# Altium schematic sheet Memory_schematic.SchDoc
size A1; SheetNumber: 1; SheetTotal: 1
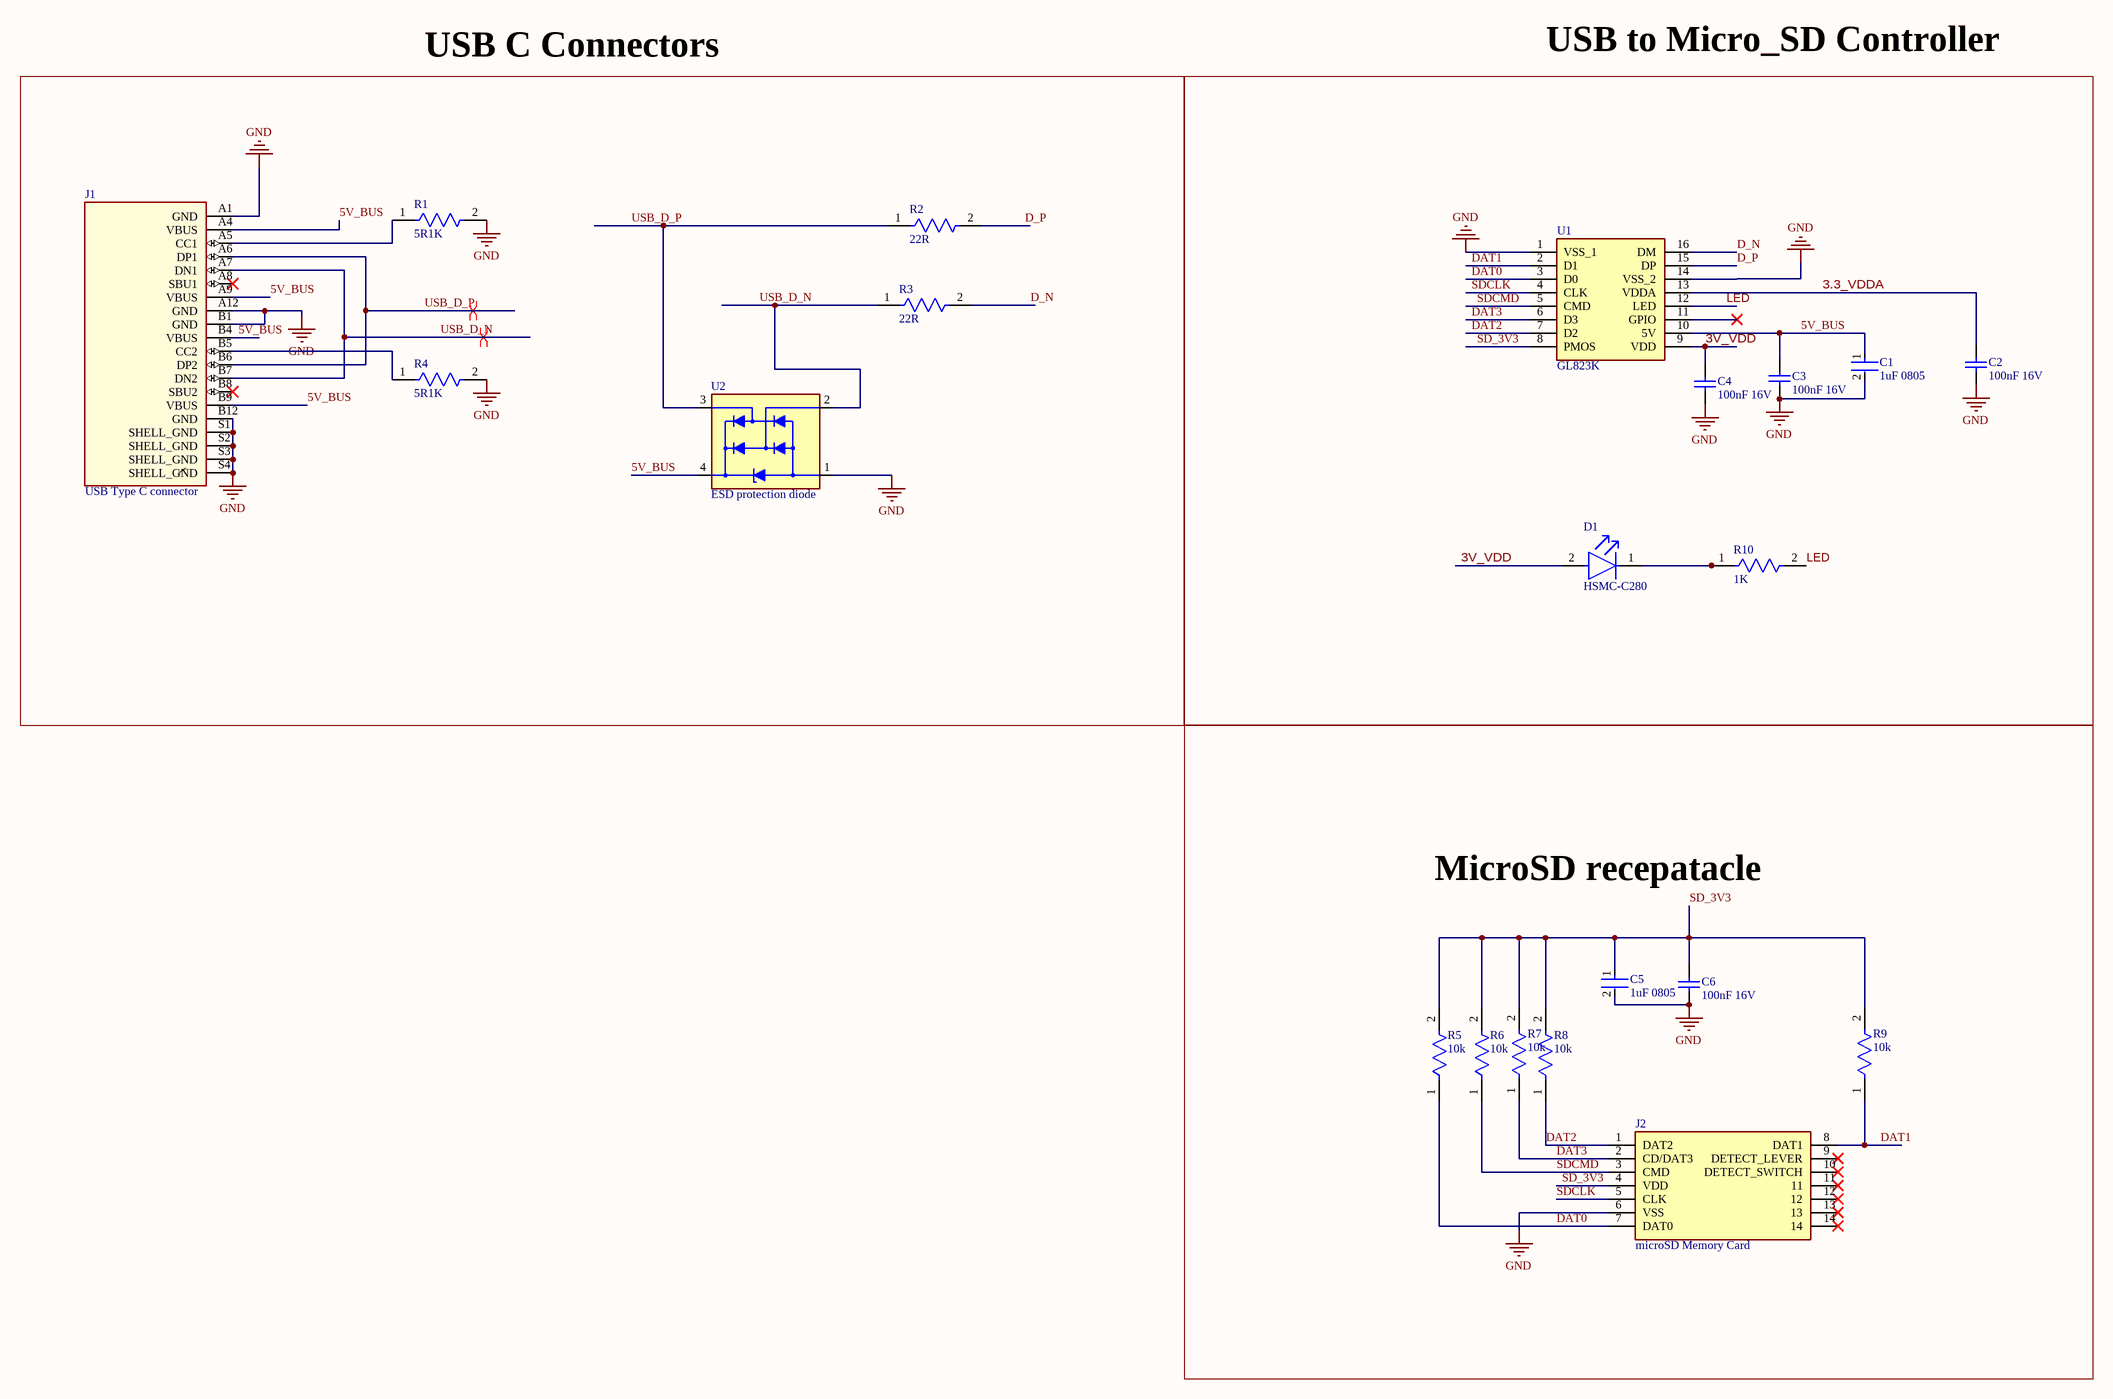
[diagram p0: Memory_schematic.SchDoc]

## Parts
C1  1uF 0805  [FP-CC0805-0_85-MFG]
C2  100nF 16V  [CAPC0805(2012)145_M]
C3  100nF 16V  [CAPC0805(2012)145_M]
C4  100nF 16V  [CAPC0805(2012)145_M]
C5  1uF 0805  [FP-CC0805-0_85-MFG]
C6  100nF 16V  [CAPC0805(2012)145_M]
D1  HSMC-C280  [FP-HSMC-C280-MFG]
J1  USB Type C connector  [CONN16_C16PIN_SHN]
J2  microSD Memory Card  [5033981892]
R1  5R1K  [FP-RN73R2A-IPC_C]
R2  22R  [FP-RT0805-MFG]
R3  22R  [FP-RT0805-MFG]
R4  5R1K  [FP-RN73R2A-IPC_C]
R5  10k  [FP-CRGP0805-IPC_C]
R6  10k  [FP-CRGP0805-IPC_C]
R7  10k  [FP-CRGP0805-IPC_C]
R8  10k  [FP-CRGP0805-IPC_C]
R9  10k  [FP-CRGP0805-IPC_C]
R10  1K  [FP-RN73R2A-IPC_A]
U1  GL823K  [SOP64P600X175-16N]
U2  ESD protection diode  [SOT190P230X110-4N]

## Blocks framed on the sheet
USB C Connectors: J1 R1-R4 U2
USB to Micro_SD Controller: C1-C4 D1 R10 U1
MicroSD recepatacle: C5 C6 J2 R5-R9

## Nets
GND: C1.2 C2.1 C3.1 C4.1 C5.2 C6.1 J1.A1(GND) J1.A12(GND) J1.B1(GND) J1.B12(GND) J1.S1(SHELL_GND) J1.S2(SHELL_GND) J1.S3(SHELL_GND) J1.S4(SHELL_GND) J2.6(VSS) R1.2 R4.2 U1.1(VSS_1) U1.14(VSS_2) U2.1(GND)
3.3_VDDA: C2.2 U1.13(VDDA)
3V_VDD: C4.2 D1.2(A) U1.9(VDD)
5V_BUS: C1.1 C3.2 J1.A4(VBUS) J1.A9(VBUS) J1.B4(VBUS) J1.B9(VBUS) U1.10(5V) U2.4(VCC)
D_N: R3.2 U1.16(DM)
D_P: R2.2 U1.15(DP)
DAT0: J2.7(DAT0) R5.1 U1.3(D0)
DAT1: J2.8(DAT1) R9.1 U1.2(D1)
DAT2: J2.1(DAT2) R8.1 U1.7(D2)
DAT3: J2.2(CD/DAT3) R7.1 U1.6(D3)
LED: R10.2 U1.12(LED)
SD_3V3: C5.1 C6.2 J2.4(VDD) R5.2 R6.2 R7.2 R8.2 R9.2 U1.8(PMOS)
SDCLK: J2.5(CLK) U1.4(CLK)
SDCMD: J2.3(CMD) R6.1 U1.5(CMD)
USB_D_N: J1.A7(DN1) J1.B7(DN2) R3.1 U2.2(I/O_1)
USB_D_P: J1.A6(DP1) J1.B6(DP2) R2.1 U2.3(I/O_2)
NetD1_1: D1.1(C) R10.1
NetJ1_A5: J1.A5(CC1) R1.1
NetJ1_B5: J1.B5(CC2) R4.1

Not connected (* = marked no-connect by the designer): J1 A8(SBU1)* B8(SBU2)*; J2 9(DETECT_LEVER)* 10(DETECT_SWITCH)* 11* 12* 13* 14*; U1 11(GPIO)*

## Layout directives
differential pair: USB_D_N, USB_D_P

## Library data of the parts
C1 C5 = CMP-03422-000058-1: CC0805 1 uF X7R 10.00% 16 V; Manufacturer: Yageo; Manufacturer Part Number: CC0805KFX7R7BB105; Material: Ceramic; Tolerance: 0.1; Voltage Rating: 16 V; ComponentLink2URL: http://www.yageo.com/documents/recent/UPY-GPHC_Y5V_6.3V-to-50V_8.pdf; Capacitance: 1 uF; Octopart: https://octopart.com/cc0805kfx7r7bb105-yageo-30261725; Footprint Url: http://www.yageo.com/exep/pages/download/literatures/UPY-C_GEN_24.pdf; ComponentLink2Description: Datasheet; Ipc Land Pattern Name: CAPC200125X85; Category: Cap; Device Class L1: Passive Components; Temperature Range High: +85°C; Mouser Description: Multilayer Ceramic Capacitors MLCC - SMD/SMT 1.0uF 16V X7R 10%; Height: 0.95mm; Automotive: No; Device Class L3: Ceramic Capacitors; Temperature: -30°C to +85°C; Temperature Range Low: -30°C; Temperature Characteristic: X7R; Device Class L2: Capacitors; Lead Free: Yes; Value: 1 uF; RoHS: TRUE; Package: CC0805-0.85
C2-C4 C6 = CMP-1036-04399-1: CAP 100nF 16V ±5% 0805 (2012 Metric) Thickness 1.45mm SMD; Tolerance: Â±5%; Case-Metric: 2012; Case-EIA: 0805; Value: 100nF; Rated Voltage: 16 V; Max Thickness: 1.45 mm; Technology: SMT
D1 = CMP-18399-000022-1: LED RED DIFFUSED 0402 SMD; Dominant Wavelength: 626nm; Number of Elements: 1; Luminous Intensity: 90mcd; Viewing Angle: 130°; Reverse Voltage: 5V; Forward Current: 20mA; Lens Color: White; Power Rating: 60mW; Forward Voltage: 1.9V; Luminous Flux: 155lm; Contact Plating: Gold; Number of Pins: 2; REACH SVHC: No SVHC; Lens Style: Diffused; Color: Red; Packaging: Tape and Reel; Max Operating Temperature: 85°C; Radiation Hardening: No; Length: 1mm; Number of LEDs: 1; Case/Package: 0402; Min Operating Temperature: -40°C; Case Code (Metric): 1005; Case Code (Imperial): 0402; Test Current: 20mA; Lead Free: Lead Free; Height: 0.4mm; Illumination Color: Red; Max Power Dissipation: 60mW; Package Quantity: 4000; Mount: Surface Mount; Wavelength: 626nm; Depth: 0.5mm; Lens Transparency: Diffused; Power Dissipation: 60mW; Width: 0.5mm
J1 = TYPE-C 16PIN 2MD(073) SHOU HAN: https://jlcpcb.com/partdetail/ShouHan-TYPE_C_16PIN_2MD_073/C2765186?utm_source=chatgpt.com
J2 = 503398-1892: 1.10mm Pitch microSD Memory Card Connector, Normal Mount Surface Mount, Push-Push Type, 1.28mm Height; Manufacturer: Molex; Manufacturer Lifecycle Status: ACTIVE; Contact Resistance: 100mΩ; Current Rating: 500mA; Gender: Male; Insulation Resistance: 1GΩ; Memory Format: FLASH; Number of Circuits: 8; Number of Ports: 1; Pitch: 1.1mm; Plating: Tin; Plating Thickness: 508nm; Voltage Rating: 10V; Supplier: RS; Supplier Part Number: 8801277; Manufacturer Part Number: 503398-1892; RoHS: Compliant; Category: Memory Connectors; Stock: 952; Pricing: 1=1.86, 10=1.42, 20=1.39, 50=1.36, 100=1.32 (GBP); China RoHS: Compliant; Connector Type: Connector; Contact Gender: Female; Contact Material: Gold, Tin; Contact Plating: Gold; Country of Origin: VN; Depth: 14.05mm; Export Control Classification Number (ECCN) Code: EAR99; Halogen Free: Low Halogen; Height: 1.4mm; Housing Material: Stainless Steel; Harmonized Tariff Schedule (HTS) Code: 8536.69.40.40; Introduction Date: 2013-02-28; Length: 13.6mm; Lifecycle Status: Production; Max Operating Temperature: 85°C; Min Operating Temperature: -25°C; Mounting Technology: Surface Mount; Number of Contacts: 8; Pins: 8; Number of Rows: 1; Orientation: Right Angle; Packaging: Cut Tape; Radiation Hardening: No; REACH SVHC: Yes; Schedule B: 8536695050, 8536695050|8536695050, 8536695050|8536695050|8536695050, 8536695050|8536695050|8536695050|8536695050; Terminal Pitch: 1.1mm; Termination: Solder; Voltage Rating (AC): 10V; Width: 14.05mm; ComponentLink1URL: https://datasheet.octopart.com:443/503398-1892-Molex-datasheet-180775278.pdf?src-supplier=IHS; ComponentLink1Description: https://datasheet.octopart.com:443/503398-1892-Molex-datasheet-180775278.pdf?src-supplier=IHS; ComponentLink2URL: https://datasheet.octopart.com:443/503398-1892-Molex-datasheet-138898078.pdf?src-supplier=Sager+Electronics; ComponentLink2Description: https://datasheet.octopart.com:443/503398-1892-Molex-datasheet-138898078.pdf?src-supplier=Sager+Electronics; ComponentLink3URL: https://datasheet.octopart.com:443/503398-1892-Molex-datasheet-16405786.pdf?src-supplier=Sager+Electronics; ComponentLink3Description: https://datasheet.octopart.com:443/503398-1892-Molex-datasheet-16405786.pdf?src-supplier=Sager+Electronics; ComponentLink4URL: https://sigma.octopart.com:443/138898079/technical_drawing/Molex-503398-1892.pdf?src-supplier=Upverter; ComponentLink4Description: https://sigma.octopart.com:443/138898079/technical_drawing/Molex-503398-1892.pdf?src-supplier=Upverter; ComponentLink5URL: https://sigma.octopart.com:443/16405789/technical_drawing/Molex-503398-1892.pdf?src-supplier=Molex; ComponentLink5Description: https://sigma.octopart.com:443/16405789/technical_drawing/Molex-503398-1892.pdf?src-supplier=Molex; ComponentLink6URL: https://datasheet.octopart.com:443/503398-1892-Molex-datasheet-66628509.pdf?src-supplier=Farnell; ComponentLink6Description: https://datasheet.octopart.com:443/503398-1892-Molex-datasheet-66628509.pdf?src-supplier=Farnell; ComponentLink7URL: https://datasheet.octopart.com:443/503398-1892-Molex-datasheet-10952502.pdf?src-supplier=Newark; ComponentLink7Description: https://datasheet.octopart.com:443/503398-1892-Molex-datasheet-10952502.pdf?src-supplier=Newark; ComponentLink8URL: https://datasheet.octopart.com:443/503398-1892-Molex-datasheet-62087832.pdf?src-supplier=Newark; ComponentLink8Description: https://datasheet.octopart.com:443/503398-1892-Molex-datasheet-62087832.pdf?src-supplier=Newark; ComponentLink9URL: https://datasheet.octopart.com:443/503398-1892-Molex-datasheet-154753182.pdf?src-supplier=Master+Electronics; ComponentLink9Description: https://datasheet.octopart.com:443/503398-1892-Molex-datasheet-154753182.pdf?src-supplier=Master+Electronics; ComponentLink10URL: https://datasheet.octopart.com:443/503398-1892-Molex-datasheet-17852981.pdf?src-supplier=element14+APAC; ComponentLink10Description: https://datasheet.octopart.com:443/503398-1892-Molex-datasheet-17852981.pdf?src-supplier=element14+APAC; ComponentLink11URL: https://datasheet.octopart.com:443/503398-1892-Molex-datasheet-140185767.pdf?src-supplier=RS+(Formerly+Allied+Electronics); ComponentLink11Description: https://datasheet.octopart.com:443/503398-1892-Molex-datasheet-140185767.pdf?src-supplier=RS+(Formerly+Allied+Electronics); ComponentLink12URL: https://datasheet.octopart.com:443/503398-1892-Molex-datasheet-120152253.pdf?src-supplier=RS+(Formerly+Allied+Electronics); ComponentLink12Description: https://datasheet.octopart.com:443/503398-1892-Molex-datasheet-120152253.pdf?src-supplier=RS+(Formerly+Allied+Electronics); ComponentLink13URL: https://datasheet.octopart.com:443/503398-1892-Molex-datasheet-62059324.pdf?src-supplier=RS+(Formerly+Allied+Electronics); ComponentLink13Description: https://datasheet.octopart.com:443/503398-1892-Molex-datasheet-62059324.pdf?src-supplier=RS+(Formerly+Allied+Electronics); ComponentLink14URL: https://datasheet.octopart.com:443/503398-1892-Molex-datasheet-24577251.pdf?src-supplier=TME; ComponentLink14Description: https://datasheet.octopart.com:443/503398-1892-Molex-datasheet-24577251.pdf?src-supplier=TME; ComponentLink15URL: http://sigma.octopart.com:80/16405788/rohs_statement/Molex-503398-1892.pdf?src-supplier=Compliance+Statements; ComponentLink15Description: http://sigma.octopart.com:80/16405788/rohs_statement/Molex-503398-1892.pdf?src-supplier=Compliance+Statements; ComponentLink16URL: http://sigma.octopart.com:80/reach_statement/Molex-company-74.pdf?src-supplier=Compliance+Statements; ComponentLink16Description: http://sigma.octopart.com:80/reach_statement/Molex-company-74.pdf?src-supplier=Compliance+Statements; ComponentLink17URL: http://sigma.octopart.com:80/rohs_statement/Molex-company-73.pdf?src-supplier=Compliance+Statements; ComponentLink17Description: http://sigma.octopart.com:80/rohs_statement/Molex-company-73.pdf?src-supplier=Compliance+Statements; ComponentLink18URL: http://sigma.octopart.com:80/conflict_mineral_statement/Molex-company-72.pdf?src-supplier=Compliance+Statements; ComponentLink18Description: http://sigma.octopart.com:80/conflict_mineral_statement/Molex-company-72.pdf?src-supplier=Compliance+Statements
R1 R4 = CMP-04015-014497-1: 5.1kΩ ±0.05% 0.125W, 1/8W Chip Resistor 0805 (2012 Metric) Moisture Resistant Thin Film
R2 R3 = CMP-03412-017128-1: RES SMD 22 OHM 1% 1/8W 0805; Manufacturer: Yageo; Manufacturer Part Number: RT0805FRD0722RL; Voltage Rating: 150V; Power Rating: 0.125W; Tolerance: 0.0001; Temperature Coefficient: 25 ppm/°C; Resistance: 22Ω; Value: 22Ω; RoHS: TRUE; Temperature Range Low: -55°C; Temperature: -55°C to +155°C; Series: RT; Device Class L3: Chip SMD Resistors; Device Class L1: Passive Components; Lead Free: Yes; Height: 0.6mm; Composition: Thin Film; Category: Res; Temperature Range High: +155°C; Octopart: https://octopart.com/rt0805frd0722rl-yageo-71399874; Digikey Description: RES SMD 22 OHM 1% 1/8W 0805; Device Class L2: Resistors; ComponentLink2Description: Datasheet; Footprint Url: http://www.yageo.com/exep/pages/download/literatures/PYu-R_Mount_10.pdf; Automotive: No; Package: RT0805; Ipc Land Pattern Name: RESC200125X50; ComponentLink2URL: http://www.yageo.com/documents/recent/PYu-RT_1-to-0.01_RoHS_L_9.pdf
R5-R9 = CMP-03211-006861-1: CRGP 0805 10K 1% CRGP0805F10K; Manufacturer: TE; Power Rating: 0.33W; Voltage Rating: 150V; Value: 10KΩ; Tolerance: 0.01; Temperature Coefficient: ±100ppm/°C; Manufacturer Part Number: CRGP0805F10K; ComponentLink2URL: https://www.mouser.com/datasheet/2/418/NG_DS_9-1773463-9_A-1358566.pdf; Temperature Range Low: -55°C; Ipc Land Pattern Name: RESC200125X55; Device Class L2: Resistors; Automotive: No; Device Class L3: Chip SMD Resistors; Composition: Thick Film; Temperature Range High: +155°C; Temperature: -55°C to +155°C; Height: 0.65mm; Series: CRGP; RoHS: TRUE; Device Class L1: Passive Components; Octopart: https://octopart.com/crgp0805f10k-te+connectivity-91018782; Package: CRGP0805; Digikey Description: CRGP 0805 10K 1%; Ambient Temperature Range High: +70°C; Lead Free: Yes; ComponentLink2Description: Datasheet; Category: Res; Resistance: 10KΩ
R10 = CMP-04015-026717-1: 1kΩ ±0.1% 0.125W, 1/8W Chip Resistor 0805 (2012 Metric) Moisture Resistant Thin Film
U1 = GL823K-HCY04: USB 2.0 card reader controller
U2 = PRTR5V0U2X,215: PRTR Series 9 V 1 pF Rail-to-Rail ESD Protection Diode - SOT-143B; Manufacturer: Nexperia; Manufacturer Lifecycle Status: RELEASED FOR SUPPLY; Breakdown Voltage: 7.5V; Value: 1pF; Direction: Bidirectional; Max Breakdown Voltage: 9V; Min Breakdown Voltage: 6V; Number of Channels: 2; Number of Elements: 1; Operating Supply Voltage: 700mV; Peak Reverse Current: 100nA; Polarity: Unidirectional; Reverse Standoff Voltage: 3V; Supplier: DigiKey; Supplier Part Number: 1727-3884-1-ND; Manufacturer Part Number: PRTR5V0U2X,215; RoHS: Compliant; Category: ESD and Circuit Protection ICs; Pricing: 1=0.66, 10=0.41, 100=0.2626, 500=0.19912, 1000=0.17862, 3000=0.15255, 6000=0.13942, 9000=0.13273, 15000=0.1252, 21000=0.12075, 30000=0.11642, 75000=0.11275 (USD); Ambient Temperature Range High: 85°C; China RoHS: Compliant; Contact Plating: Tin; Country of Origin: Mainland China; Export Control Classification Number (ECCN) Code: EAR99; Height: 1.1mm; Harmonized Tariff Schedule (HTS) Code: 8541.10.00.50; Introduction Date: 2005-09-23; Lifecycle Status: Production; Max Operating Temperature: 85°C; Min Operating Temperature: -40°C; Pins: 4; Number of Terminals: 4; REACH SVHC: Yes; Schedule B: 8541100080, 8541100080|8541100080|8541100080|8541100080|8541100080|8541100080|8541100080|8541100080|8541100080|8541100080|8541100080|8541100080|8541100080|8541100080|8541100080|8541100080|8541100080|8541100080|8541100080|8541100080|8541100080|8541100080|8541100080|85; ComponentLink1Description: https://datasheet.octopart.com:443/PRTR5V0U2X%2C215-Nexperia-datasheet-180924939.pdf?src-supplier=IHS; ComponentLink2URL: https://datasheet.octopart.com:443/PRTR5V0U2X%2C215-Nexperia-datasheet-5405949.pdf?src-supplier=IHS; ComponentLink2Description: https://datasheet.octopart.com:443/PRTR5V0U2X%2C215-Nexperia-datasheet-5405949.pdf?src-supplier=IHS; ComponentLink3URL: https://datasheet.octopart.com:443/PRTR5V0U2X%2C215-Nexperia-datasheet-137756210.pdf?src-supplier=Newark; ComponentLink3Description: https://datasheet.octopart.com:443/PRTR5V0U2X%2C215-Nexperia-datasheet-137756210.pdf?src-supplier=Newark; ComponentLink4URL: https://sigma.octopart.com:443/138810744/technical_drawing/Nexperia-PRTR5V0U2X%2C215.pdf?src-supplier=Upverter; ComponentLink4Description: https://sigma.octopart.com:443/138810744/technical_drawing/Nexperia-PRTR5V0U2X%2C215.pdf?src-supplier=Upverter; ComponentLink5URL: https://datasheet.octopart.com:443/PRTR5V0U2X%2C215-Nexperia-datasheet-87582154.pdf?src-supplier=Nexperia; ComponentLink5Description: https://datasheet.octopart.com:443/PRTR5V0U2X%2C215-Nexperia-datasheet-87582154.pdf?src-supplier=Nexperia; ComponentLink6URL: https://datasheet.octopart.com:443/PRTR5V0U2X%2C215-NXP-Semiconductors-datasheet-15938047.pdf?src-supplier=iiiC; ComponentLink6Description: https://datasheet.octopart.com:443/PRTR5V0U2X%2C215-NXP-Semiconductors-datasheet-15938047.pdf?src-supplier=iiiC; ComponentLink7URL: http://sigma.octopart.com:80/reach_statement/NXP-Semiconductors-company-13.pdf?src-supplier=Compliance+Statements; ComponentLink7Description: http://sigma.octopart.com:80/reach_statement/NXP-Semiconductors-company-13.pdf?src-supplier=Compliance+Statements; ComponentLink8URL: http://sigma.octopart.com:80/rohs_statement/NXP-Semiconductors-company-12.pdf?src-supplier=Compliance+Statements; ComponentLink8Description: http://sigma.octopart.com:80/rohs_statement/NXP-Semiconductors-company-12.pdf?src-supplier=Compliance+Statements